# Altium project main board.PrjPcb
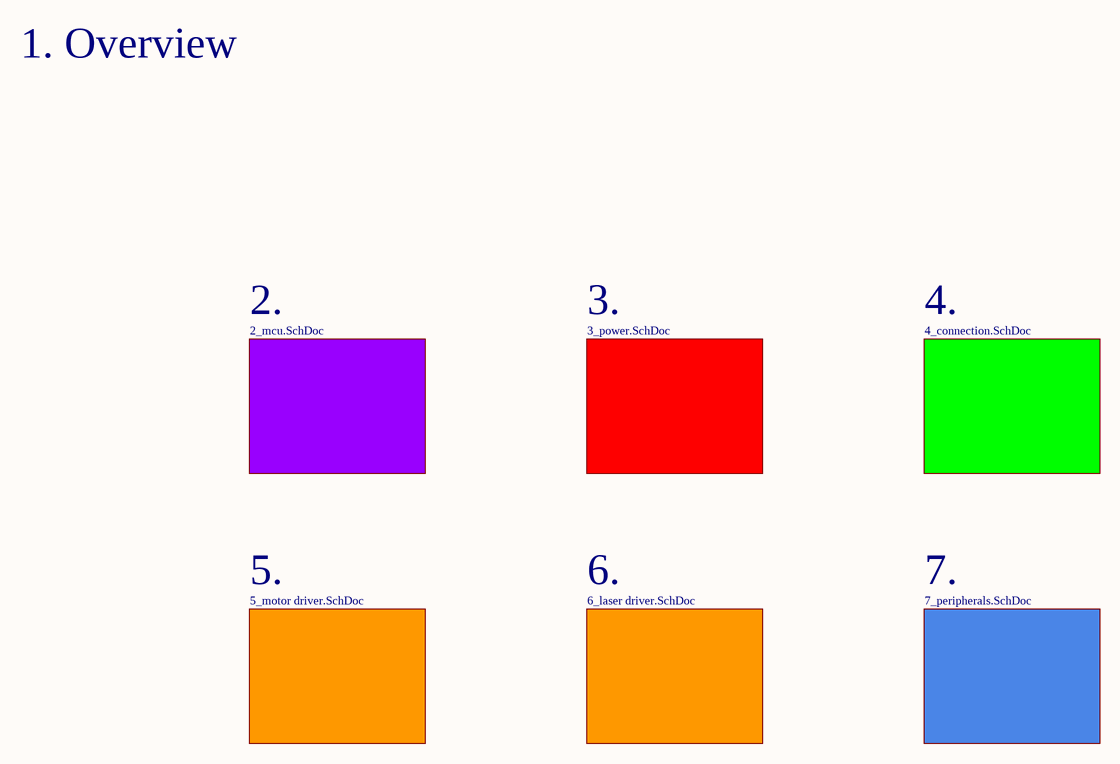
[diagram p0: 1_overview.SchDoc]
7 sheets, 131 parts. Net scope: flat (ports and power ports of the same name join across sheets).
Board files: main board.PcbDoc, panel.PcbDoc
Sheets:
  1_overview.SchDoc
    Designator = 2_mcu.SchDoc
    Designator = 3_power.SchDoc
    Designator = 4_connection.SchDoc
    Designator = 5_motor driver.SchDoc
    Designator = 6_laser driver.SchDoc
    Designator = 7_peripherals.SchDoc

## Sheet 1_overview.SchDoc
size A4; SheetNumber: 1; SheetTotal: 7

### Sub-sheets
Designator = 2_mcu.SchDoc: no entries
Designator = 3_power.SchDoc: no entries
Designator = 4_connection.SchDoc: no entries
Designator = 5_motor driver.SchDoc: no entries
Designator = 6_laser driver.SchDoc: no entries
Designator = 7_peripherals.SchDoc: no entries

### Notes on the sheet
- 1. Overview
- 2.
- 3.
- 4.
- 5.
- 6.
- 7.

## Sheet 2_mcu.SchDoc
size A4; SheetNumber: 2; SheetTotal: 7
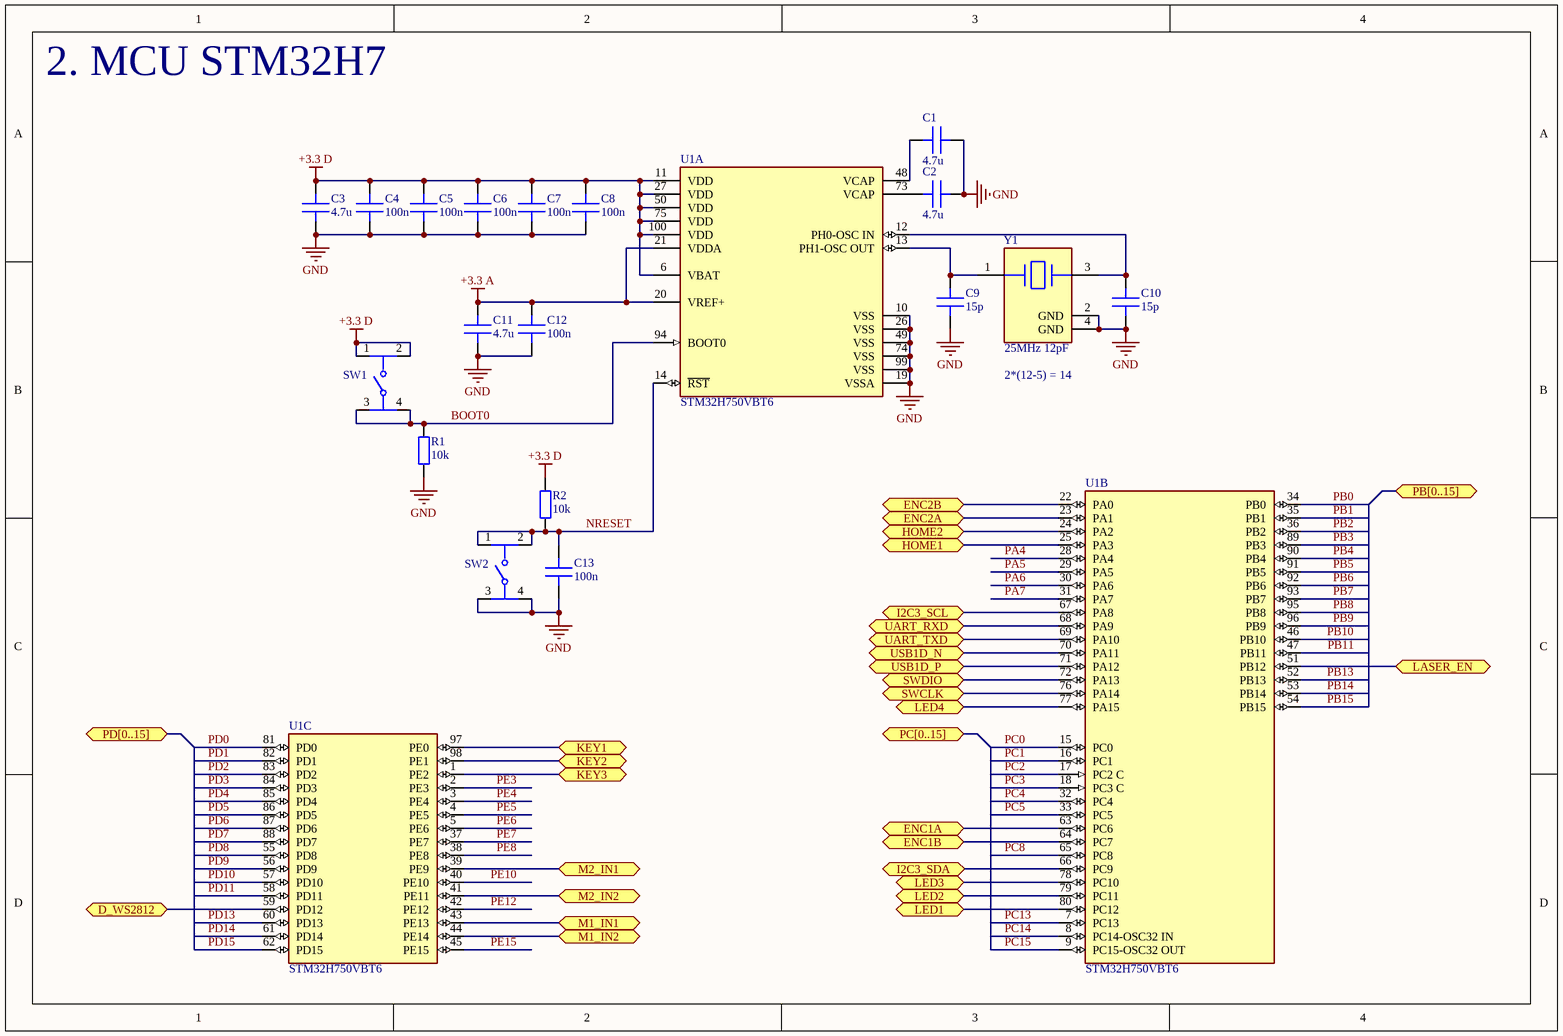
[diagram p1: 2_mcu.SchDoc]

### Parts
C1  4.7u  [IPC C C0603 NO SILK]
C2  4.7u  [IPC C C0603 NO SILK]
C3  4.7u  [IPC C C0603 NO SILK]
C4  100n  [IPC C C0402 NO SILK]
C5  100n  [IPC C C0402 NO SILK]
C6  100n  [IPC C C0402 NO SILK]
C7  100n  [IPC C C0402 NO SILK]
C8  100n  [IPC C C0402 NO SILK]
C9  15p  [IPC C C0402 NO SILK]
C10  15p  [IPC C C0402 NO SILK]
C11  4.7u  [IPC C C0603 NO SILK]
C12  100n  [IPC C C0402 NO SILK]
C13  100n  [IPC C C0402 NO SILK]
R1  10k  [IPC C R0402 NO SILK]
R2  10k  [IPC C R0402 NO SILK]
SW1  PTS810SJM250SMTRLFS  [FP-PTS810SJM250SMTRLFS-MFG]  (value not drawn)
SW2  PTS810SJM250SMTRLFS  [FP-PTS810SJM250SMTRLFS-MFG]  (value not drawn)
U1  STM32H750VBT6  [FP-LQFP100-1L-MFG]  (parts A,B,C of 3)
Y1  ABM8G-25.000MHZ-B4Y-T  [FP-ABM8G-MFG]  (value not drawn)

### Ports
D_WS2812 (bidir, see 7_peripherals[1B]), ENC1A (bidir, see 5_motor driver[4C]), ENC1B (bidir, see 5_motor driver[4C]), ENC2A (bidir, see 5_motor driver[3C]), ENC2B (bidir, see 5_motor driver[3C]), HOME1 (bidir, see 5_motor driver[4C]), HOME2 (bidir, see 5_motor driver[3C]), I2C3_SCL (bidir, see 7_peripherals[4B]), I2C3_SDA (bidir, see 7_peripherals[4B]), KEY1 (bidir, see 7_peripherals[1D]), KEY2 (bidir, see 7_peripherals[2D]), KEY3 (bidir, see 7_peripherals[2D]), LASER_EN (bidir, see 6_laser driver[3C]), LED1 (bidir, see 7_peripherals[1B]), LED2 (bidir, see 7_peripherals[1C]), LED3 (bidir, see 7_peripherals[1C]), LED4 (bidir, see 7_peripherals[1C]), M1_IN1 (bidir, see 5_motor driver[2B]), M1_IN2 (bidir, see 5_motor driver[2B]), M2_IN1 (bidir, see 5_motor driver[1C]), M2_IN2 (bidir, see 5_motor driver[1C]), PB[0..15] (bidir, see 7_peripherals[3C]), PC[0..15] (bidir), PD[0..15] (bidir, see 7_peripherals[3C]), SWCLK (bidir, see 4_connection[3B]), SWDIO (bidir, see 4_connection[3B]), UART_RXD (bidir, see 4_connection[3C]), UART_TXD (bidir, see 4_connection[3C]), USB1D_N (bidir, see 4_connection[2A]), USB1D_P (bidir, see 4_connection[2A])

### Nets
+3.3 A: C11.2 C12.2 U1.20(VREF+) U1.21(VDDA)
+3.3 D: C3.2 C4.2 C5.2 C6.2 C7.2 C8.2 R2.1 SW1.1 SW1.2 U1.6(VBAT) U1.11(VDD) U1.27(VDD) U1.50(VDD) U1.75(VDD) U1.100(VDD)
GND: C1.1 C2.1 C3.1 C4.1 C5.1 C6.1 C7.1 C8.1 C9.1 C10.1 C11.1 C12.1 C13.1 R1.2 SW2.3 SW2.4 U1.10(VSS) U1.19(VSSA) U1.26(VSS) U1.49(VSS) U1.74(VSS) U1.99(VSS) Y1.2(GND) Y1.4(GND)
BOOT0: R1.1 SW1.3 SW1.4 U1.94(BOOT0)
D_WS2812: U1.59(PD12) ; port D_WS2812
ENC1A: U1.63(PC6) ; port ENC1A
ENC1B: U1.64(PC7) ; port ENC1B
ENC2A: U1.23(PA1) ; port ENC2A
ENC2B: U1.22(PA0) ; port ENC2B
HOME1: U1.25(PA3) ; port HOME1
HOME2: U1.24(PA2) ; port HOME2
I2C3_SCL: U1.67(PA8) ; port I2C3_SCL
I2C3_SDA: U1.66(PC9) ; port I2C3_SDA
KEY1: U1.97(PE0) ; port KEY1
KEY2: U1.98(PE1) ; port KEY2
KEY3: U1.1(PE2) ; port KEY3
LASER_EN: U1.51(PB12) ; port LASER_EN
LED1: U1.80(PC12) ; port LED1
LED2: U1.79(PC11) ; port LED2
LED3: U1.78(PC10) ; port LED3
LED4: U1.77(PA15) ; port LED4
M1_IN1: U1.43(PE13) ; port M1_IN1
M1_IN2: U1.44(PE14) ; port M1_IN2
M2_IN1: U1.39(PE9) ; port M2_IN1
M2_IN2: U1.41(PE11) ; port M2_IN2
NRESET: C13.2 R2.2 SW2.1 SW2.2 U1.14(~{RST})
PA4: U1.28(PA4)
PA5: U1.29(PA5)
PA6: U1.30(PA6)
PA7: U1.31(PA7)
PB0: U1.34(PB0)
PB1: U1.35(PB1)
PB2: U1.36(PB2)
PB3: U1.89(PB3)
PB4: U1.90(PB4)
PB5: U1.91(PB5)
PB6: U1.92(PB6)
PB7: U1.93(PB7)
PB8: U1.95(PB8)
PB9: U1.96(PB9)
PB10: U1.46(PB10)
PB11: U1.47(PB11)
PB13: U1.52(PB13)
PB14: U1.53(PB14)
PB15: U1.54(PB15)
PC0: U1.15(PC0)
PC1: U1.16(PC1)
PC2: U1.17(PC2_C)
PC3: U1.18(PC3_C)
PC4: U1.32(PC4)
PC5: U1.33(PC5)
PC8: U1.65(PC8)
PC13: U1.7(PC13)
PC14: U1.8(PC14-OSC32_IN)
PC15: U1.9(PC15-OSC32_OUT)
PD0: U1.81(PD0)
PD1: U1.82(PD1)
PD2: U1.83(PD2)
PD3: U1.84(PD3)
PD4: U1.85(PD4)
PD5: U1.86(PD5)
PD6: U1.87(PD6)
PD7: U1.88(PD7)
PD8: U1.55(PD8)
PD9: U1.56(PD9)
PD10: U1.57(PD10)
PD11: U1.58(PD11)
PD13: U1.60(PD13)
PD14: U1.61(PD14)
PD15: U1.62(PD15)
PE3: U1.2(PE3)
PE4: U1.3(PE4)
PE5: U1.4(PE5)
PE6: U1.5(PE6)
PE7: U1.37(PE7)
PE8: U1.38(PE8)
PE10: U1.40(PE10)
PE12: U1.42(PE12)
PE15: U1.45(PE15)
RXD: U1.68(PA9) ; port UART_RXD
SWCLK: U1.76(PA14) ; port SWCLK
SWDIO: U1.72(PA13) ; port SWDIO
TXD: U1.69(PA10) ; port UART_TXD
USB1D_N: U1.70(PA11) ; port USB1D_N
USB1D_P: U1.71(PA12) ; port USB1D_P
NetC1_2: C1.2 U1.48(VCAP)
NetC2_2: C2.2 U1.73(VCAP)
NetC9_2: C9.2 U1.13(PH1-OSC_OUT) Y1.1
NetC10_2: C10.2 U1.12(PH0-OSC_IN) Y1.3

### Notes on the sheet
- 2. MCU STM32H7
- (near Y1) 25MHz 12pF
- (near Y1) 2*(12-5) = 14

### Library data of the parts
C1-C3 C11 = Generic CAP 0603: Value: 4.7u
C4-C10 C12 C13 = Generic CAP 0402
  C4-C8 C12 C13: Value: 100n
  C9 C10: Value: 15p
R1 R2 = Generic RES 0402: Value: 10k
SW1 SW2 = CMP-10040-000001-2: SWITCH TACTILE SPST-NO 0.05A 16V; Throw Configuration: SPST; Operating Force: 160gf; Actuator Type: Standard; Switch Travel: 0.15mm; Switch Function: Off-Mom; Max Current Rating: 50mA; Mechanical Life: 150000Cycles; Illumination Type: Non-Illuminated; Package Quantity: 2900; Depth: 4.6mm; Mount: Surface Mount; Packaging: Tape and Reel; Length: 3.2mm; RoHS Compliant: Yes; Case/Package: SMD/SMT; Voltage Rating (DC): 16V; Min Operating Temperature: -40°C; Termination: J-Bend; Lead Free: Lead Free; Contact Plating: Silver; Orientation: Straight; Max Operating Temperature: 85°C; Current Rating: 50mA; Color: Black
U1 = CMP-12105-000017-1: IC MCU 32BIT 128KB FLASH 100LQFP; Manufacturer: STMicroelectronics; Number Of Uart Channels: 9; Number Of I/Os: 82; Max Junction Temp: +125°C; Data Bus Width: 32bits; Ram Size: 1MBytes; Min Supply Voltage: 1.62V; Number Of Spi Channels: 6; Number Of Adc Channels: 36; Max Supply Voltage: 3.6V; Standoff Height: 0.05mm; Interface: I2C,SPI,UART,USART,CAN,USB,LIN,IrDA,Ethernet,I2S,Other; Number Of A/D Converters: 3; Number Of I2C Channels: 4; Memory Size: 128KBytes; Frequency: 480MHz; Number Of Timers/Counters: 20; Number Of Ethernet Channels: 1; Core Architecture: ARM Cortex-M7; Number Of Usb Channels: 2; Number Of Pwm Channels: 42; Ambient Temperature Range High: +85°C; Temperature: -40°C to +125°C; ComponentLink2URL: https://www.st.com/resource/en/datasheet/stm32h750vb.pdf; Device Class L2: Embedded Processors and Controllers; Temperature Range Low: -40°C; Octopart: https://octopart.com/stm32h750vbt6-stmicroelectronics-94048547; Category: IC; Manufacturer Part Number: STM32H750VBT6; Height: 1.6mm; Lead Free: Yes; Device Class L1: Integrated Circuits (ICs); Digikey Description: IC MCU 32BIT 128KB FLASH 100LQFP; RoHS: TRUE; Ambient Temperature Range Low: -40°C; Device Class L3: Microcontrollers; ComponentLink2Description: Datasheet; Mouser Description: MCU 32-Bit STM32H750VB ARM Cortex M7 RISC 128KB Flash 1.8V/2.5V/3.3V 100-Pin LQFP Tray; Number Of Cores: 1; Automotive: No; Memory Type: FLASH; Package: LQFP100-1L; Temperature Range High: +125°C
Y1 = CMP-27762-000021-2: Crystal 25MHz ±30ppm (Tol) ±30ppm (Stability) 10pF FUND 60Ω 4-Pin SMD T/R; ESR (Equivalent Series Resistance): 60R; Depth: 2.5mm; Frequency Stability: 30ppm; Mount: Surface Mount; Lead Free: Lead Free; Max Operating Temperature: 70°C; Series: ABM8G; Frequency Tolerance: 30ppm; Min Operating Temperature: -20°C; Number of Pins: 4; Operating Frequency: 25 MHz; Termination: SMD/SMT; Frequency: 25MHz; Case/Package: CSMD; Packaging: Tape and Reel; Package Quantity: 1000; Tolerance: 30ppm; Length: 3.2mm; Height: 0.039inch; Load Capacitance: 10pF; Width: 0.098inch; Series Resistance: 60R

## Sheet 3_power.SchDoc
size A4; SheetNumber: 3; SheetTotal: 6
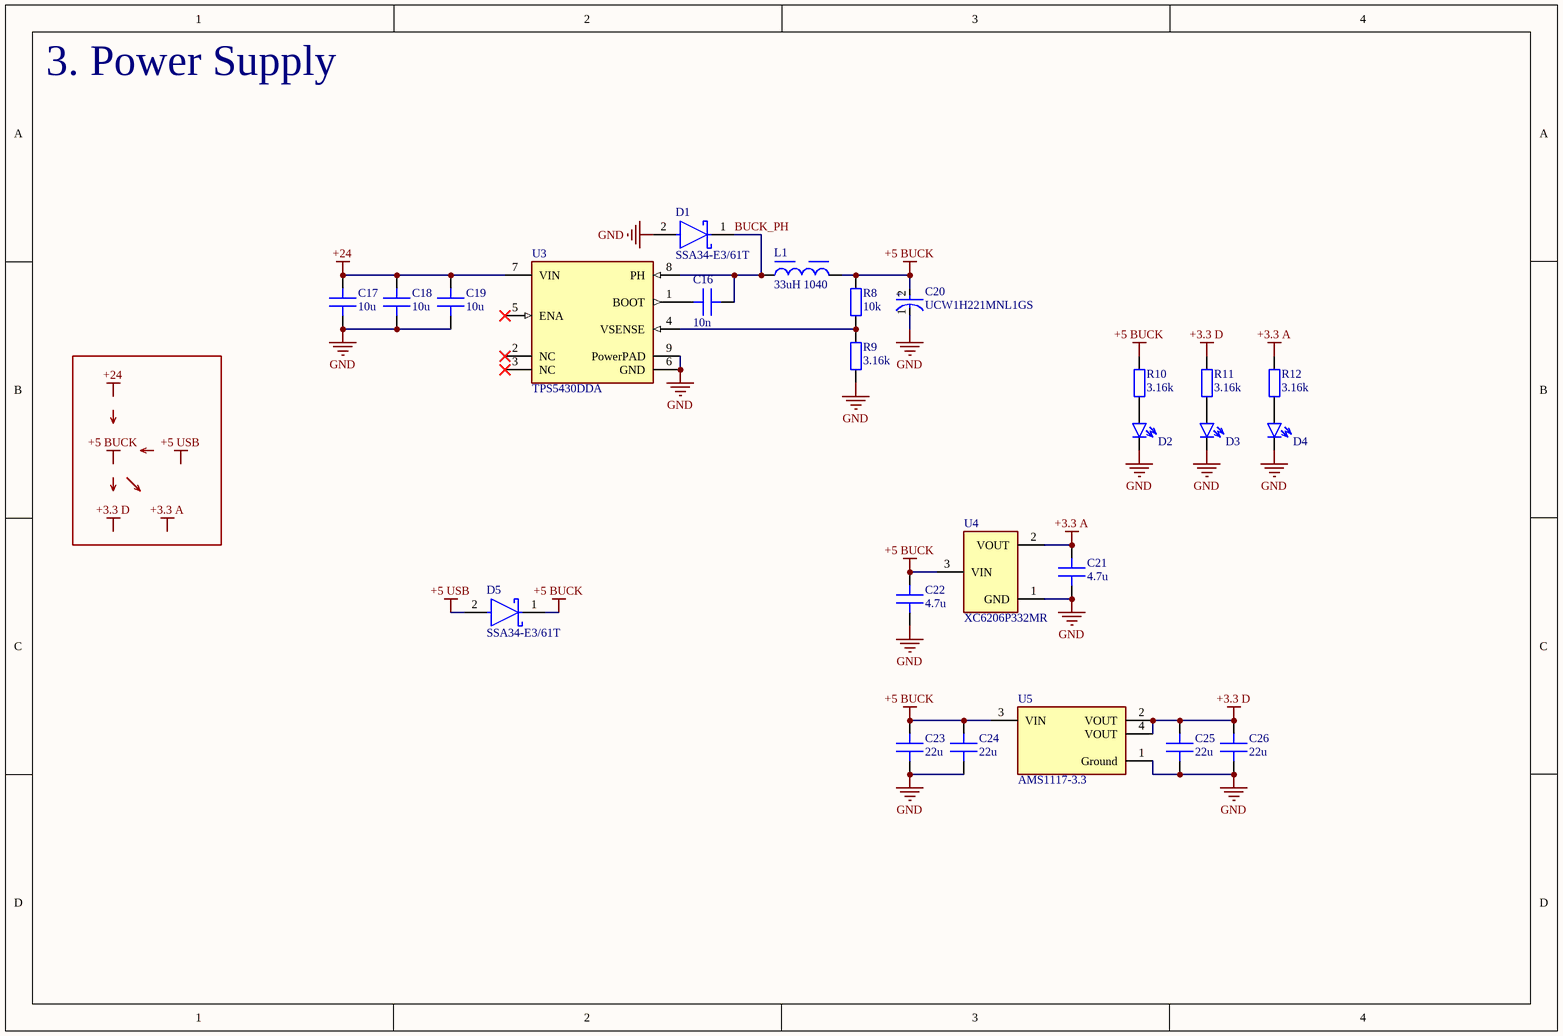
[diagram p2: 3_power.SchDoc]

### Parts
C16  10n  [IPC C C0402 NO SILK]
C17  10u  [IPC C C1210 NO SILK]
C18  10u  [IPC C C1210 NO SILK]
C19  10u  [IPC C C1210 NO SILK]
C20  UCW1H221MNL1GS  [FP-UCW1H221MNL1GS-MFG]
C21  4.7u  [IPC C C0603 NO SILK]
C22  4.7u  [IPC C C0603 NO SILK]
C23  22u  [IPC C C0603 NO SILK]
C24  22u  [IPC C C0603 NO SILK]
C25  22u  [IPC C C0603 NO SILK]
C26  22u  [IPC C C0603 NO SILK]
D1  SSA34-E3/61T  [FP-95400-MFG]
D2  Red LED 0603  [IPC C D0603]  (value not drawn)
D3  Yellow LED 0603  [IPC C D0603]  (value not drawn)
D4  Yellow LED 0603  [IPC C D0603]  (value not drawn)
D5  SSA34-E3/61T  [FP-95400-MFG]
L1  33uH 1040  [WE-LHMI_1040]
R8  10k  [IPC C R0402 NO SILK]
R9  3.16k  [IPC C R0402 NO SILK]
R10  3.16k  [IPC C R0402 NO SILK]
R11  3.16k  [IPC C R0402 NO SILK]
R12  3.16k  [IPC C R0402 NO SILK]
U3  TPS5430DDA  [FP-DDA0008J-MFG]
U4  XC6206P332MR  [SOT23-3]
U5  AMS1117-3.3  [FP-AMS1117-IPC_C]

### Nets
+3.3 A: C21.2 R12.2 U4.2(VOUT)
+3.3 D: C25.2 C26.2 R11.2 U5.2(VOUT) U5.4(VOUT)
+5 BUCK: C20.2(A) C22.2 C23.2 C24.2 D5.1(C) L1.2 R8.2 R10.2 U4.3(VIN) U5.3(VIN)
+5 USB: D5.2(A)
+24: C17.1 C18.1 C19.1 U3.7(VIN)
GND: C17.2 C18.2 C19.2 C20.1(C) C21.1 C22.1 C23.1 C24.1 C25.1 C26.1 D1.2(A) D2.2(C) D3.2(C) D4.2(C) R9.1 U3.6(GND) U3.9(PowerPAD) U4.1(GND) U5.1(Ground)
BUCK_PH: C16.2 D1.1(C) L1.1 U3.8(PH)
NetC16_1: C16.1 U3.1(BOOT)
NetD2_1: D2.1(A) R10.1
NetD3_1: D3.1(A) R11.1
NetD4_1: D4.1(A) R12.1
NetR8_1: R8.1 R9.2 U3.4(VSENSE)

Not connected (* = marked no-connect by the designer): U3 2(NC)* 3(NC)* 5(ENA)*

### Notes on the sheet
- 3. Power Supply
- Labels drawn without touching a wire or pin: +3.3 A, +3.3 D, +5 BUCK, +5 USB, +24
- (in symbol CMP-12462-000041-1) +

### Library data of the parts
C16 = Generic CAP 0402: Value: 10n
C17-C19 = Generic CAP 1210: Value: 10u
C20 = CMP-12462-000041-1: CAP ALUM 220UF 20% 50V SMD; Dissipation Factor: 0.14%; Ripple Current: 670mA; Dielectric Material: Aluminium; Life (Hours): 7000Hour; Impedance: 350mR; Leakage Current: 3uA; Capacitance: 220uF; Max Operating Temperature: 105°C; Features: General Purpose; Voltage Rating: 50V; Case/Package: Radial; Termination: SMD/SMT; Tolerance: 20%; Package Quantity: 500; Construction: Cylindrical; REACH SVHC: No SVHC; Width: 10.3mm; Min Operating Temperature: -25°C; RoHS Compliant: Yes; Mount: Surface Mount; Diameter: 10mm; Voltage: 50V; Series: CW; Voltage Rating (DC): 50V; Ripple Current (AC): 670mA; Radiation Hardening: No; Length: 10mm; Packaging: Tape and Reel; Height: 10mm; Height - Seated (Max): 0.394inch
C21-C26 = Generic CAP 0603
  C21 C22: Value: 4.7u
  C23-C26: Value: 22u
D1 D5 = CMP-02539-000022-2: DIODE SCHOTTKY 40V 3A DO214AC; Element Configuration: Single; Max Reverse Leakage Current: 200uA; Polarity: Standard; Peak Non-Repetitive Surge Current: 75A; Forward Voltage: 490mV; Radiation Hardening: No; Current Rating: 3A; Contact Plating: Tin; Output Current: 3A; Height: 2.087mm; Mount: Surface Mount; Case/Package: SMA; Packaging: Tape and Reel; Width: 2.79mm; Average Rectified Current: 3A; Max Repetitive Reverse Voltage (Vrrm): 40V; Max Operating Temperature: 150°C; Length: 4.5mm; RoHS Compliant: Yes; Max Reverse Current: 200uA; Voltage Rating (DC): 40V; Min Operating Temperature: -65°C; Max Reverse Voltage (DC): 40V; Number of Pins: 2; Max Forward Surge Current (Ifsm): 75A; Lead Free: Lead Free; Forward Current: 3A; Max Surge Current: 75A; Package Quantity: 1
D2-D4 = Generic LED 0603
L1 = CMP-1353-00014-4: NexarPartId: 67091305; Saturation Current: 3.3A; DC Resistance (DCR): 92mΩ; Inductance Tolerance: 20%; Inductance: 33µH; Max Operating Temperature: 125°C; Ambient Temperature Range High: 85°C; Min Operating Temperature: -40°C; Length: 11mm; Ambient Temperature Range Low: -40°C; Height: 3.8mm; Width: 10mm; RoHS: Compliant
R8-R12 = Generic RES 0402
  R8: Value: 10k
  R9-R12: Value: 3.16k
U3 = CMP-2000-04960-2: IC REG BUCK ADJUSTABLE 3A 8SOPWR; Manufacturer: Texas Instruments; Max Junction Temp: +125°C; Max Supply Voltage: 36V; Switching Frequency: 500kHz; Output Type: AdjustableProgrammable; Standoff Height: 0mm; Output Voltage: 1.23-31V; Max Duty Cycle: 89%; Nominal Supply Current: 3mA; Min Supply Voltage: 5.5V; Number Of Outputs: 1; Temperature: -40°C to +125°C; Temperature Range High: +125°C; Manufacturer Part Number: TPS5430DDA; Device Class L3: Voltage Regulators - Switching; Mouser Description: Voltage Regulators - Switching Regulators 5.5 to 36V Input 3A Step Dwn Converter; Switching Topology: Buck; ComponentLink2URL: http://www.ti.com/lit/ds/symlink/tps5431.pdf; ComponentLink2Description: Datasheet; Device Class L2: Power Management ICs; Device Class L1: Integrated Circuits (ICs); Digikey Description: IC REG BUCK ADJUSTABLE 3A 8SOPWR; RoHS: TRUE; Octopart: https://octopart.com/tps5430dda-texas+instruments-589977; Output Current: 3A; Automotive: No; Lead Free: Yes; Category: IC; Package: DDA0008J; Temperature Range Low: -40°C; Height: 1.7mm
U4 = 3.3V Regulator XC6206P332MR_C5446: Output Type: Output Polarity:Positive Number of Outputs:1 Maximum Input Voltage:6V Output Voltage:3.3V~3.3V Output Voltage:3.3V~3.3V Dropout Voltage:680mV@(100mA) Output Current:200mA Power Supply Rejection Ratio (PSRR):-; Manufacturer: TOREX(特瑞仕); Add into BOM: yes; Number of Outputs: 1; Maximum Input Voltage: 6V; Output Current: 200mA; Symbol: XC6206P332MR; Device: XC6206P332MR_C5446; LCSC Part Name: 正 Vin=6V Vout=3.3V 200mA; Supplier Part: C5446; Manufacturer Part: XC6206P332MR; Supplier Footprint: SOT-23-3L; JLCPCB Part Class: Basic Part; Datasheet: https://atta.szlcsc.com/upload/public/pdf/source/20130801/1457706628791.pdf; Supplier: LCSC; Convert to PCB: yes; Output Polarity: Positive; Output Voltage: 3.3V~3.3V; Dropout Voltage: 680mV@(100mA); Power Supply Rejection Ratio (PSRR): -
U5 = CMP-209535-000001-1: LDO Voltage Regulators 1A, 3.3V; Manufacturer: Advanced Monolithic Systems; Dropout Voltage: 1.1V; Output Type: Fixed; Nominal Supply Current: 5mA; Max Power Dissipation: 1.2W; Max Supply Voltage: 15V; Number Of Outputs: 1; Standoff Height: 0.64mm; Max Junction Temp: +125°C; Height: 1.8mm; Package: AMS1117; Device Class L2: Power Management ICs; ComponentLink2Description: Datasheet; ComponentLink2URL: http://www.advanced-monolithic.com/pdf/ds1117.pdf; Category: IC; RoHS: TRUE; Automotive: No; Device Class L1: Integrated Circuits (ICs); Output Current: 1A; Device Class L3: Voltage Regulators - Linear; Temperature: -40°C to +125°C; Output Voltage: 3.3V; Manufacturer Part Number: AMS1117-3.3; Temperature Range Low: -40°C; Octopart: https://octopart.com/ams1117-3.3-advanced+monolithic+systems-25899300; Lead Free: Yes; Ipc Land Pattern Name: SOT229P700X180-4; Temperature Range High: +125°C

## Sheet 4_connection.SchDoc
size A4; SheetNumber: 4; SheetTotal: 7
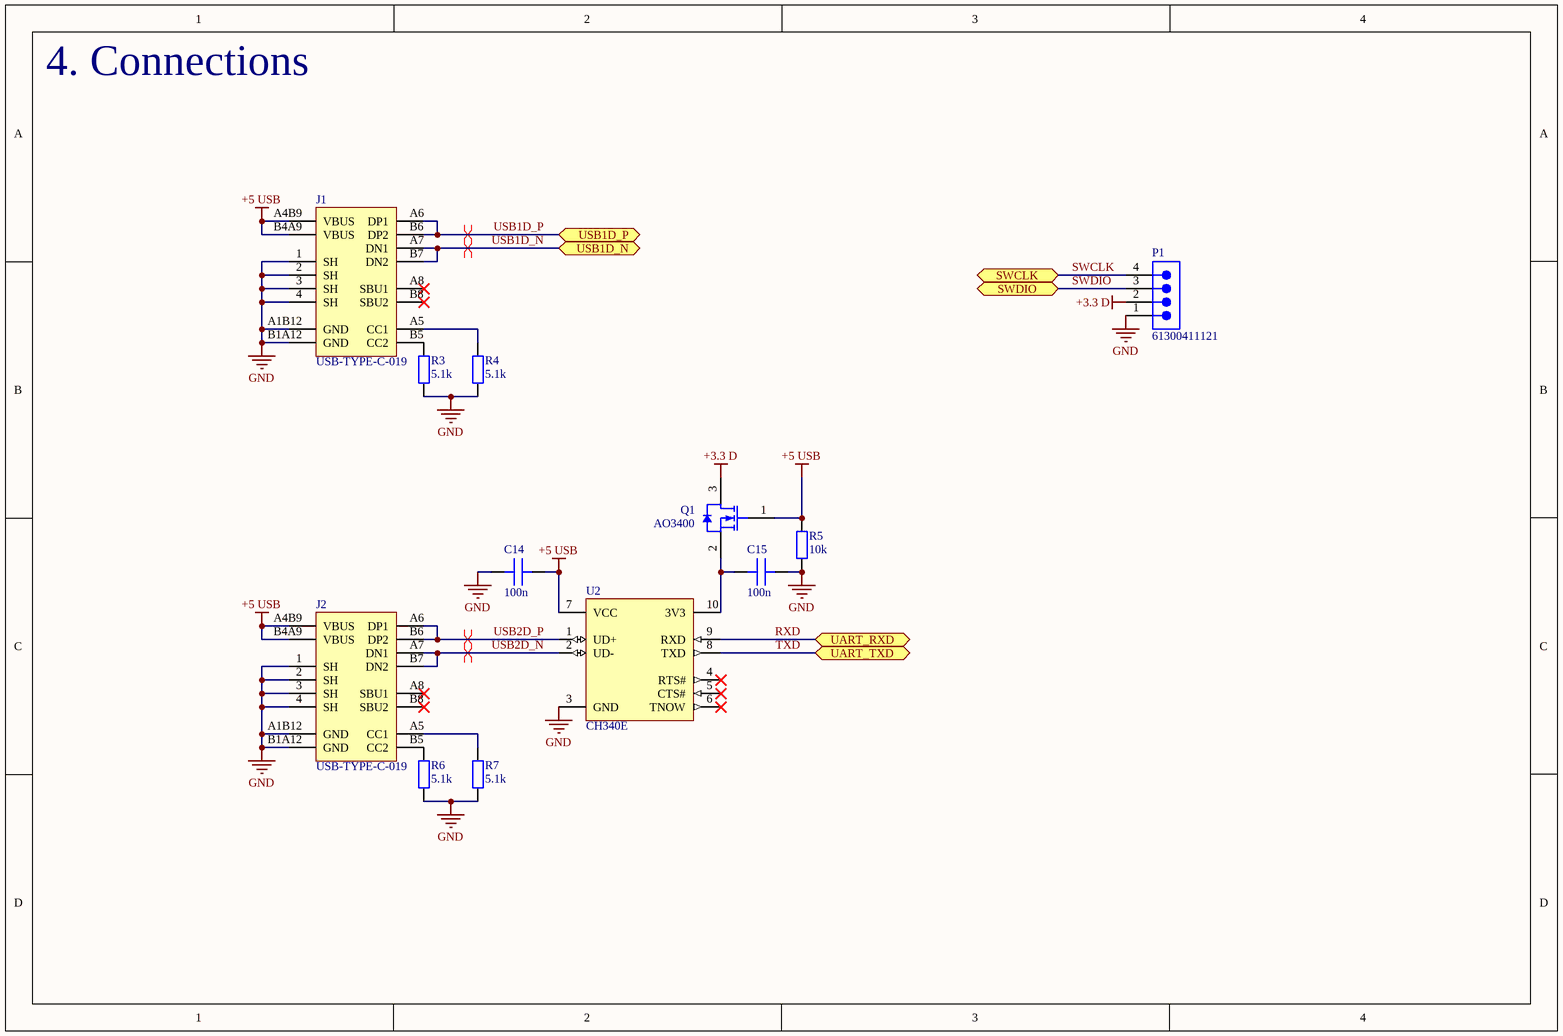
[diagram p3: 4_connection.SchDoc]

### Parts
C14  100n  [IPC C C0402 NO SILK]
C15  100n  [IPC C C0402 NO SILK]
J1  USB-TYPE-C-019  [USB-TYPE-C-12+4P]
J2  USB-TYPE-C-019  [USB-TYPE-C-12+4P]
P1  61300411121  [61300411121]
Q1  AO3400  [AO-SOT23-3_V]
R3  5.1k  [IPC C R0402 NO SILK]
R4  5.1k  [IPC C R0402 NO SILK]
R5  10k  [IPC C R0402 NO SILK]
R6  5.1k  [IPC C R0402 NO SILK]
R7  5.1k  [IPC C R0402 NO SILK]
U2  CH340E  [MSOP-UN10_L]

### Ports
SWCLK (bidir, see 2_mcu[3C]), SWDIO (bidir, see 2_mcu[3C]), UART_RXD (bidir, see 2_mcu[3C]), UART_TXD (bidir, see 2_mcu[3C]), USB1D_N (bidir, see 2_mcu[3C]), USB1D_P (bidir, see 2_mcu[3C])

### Nets
+3.3 D: P1.2 Q1.3(D)
+5 USB: C14.2 J1.A4B9(VBUS) J1.B4A9(VBUS) J2.A4B9(VBUS) J2.B4A9(VBUS) Q1.1(G) R5.2 U2.7(VCC)
GND: C14.1 C15.1 J1.1(SH) J1.2(SH) J1.3(SH) J1.4(SH) J1.A1B12(GND) J1.B1A12(GND) J2.1(SH) J2.2(SH) J2.3(SH) J2.4(SH) J2.A1B12(GND) J2.B1A12(GND) P1.1 R3.1 R4.1 R5.1 R6.1 R7.1 U2.3(GND)
RXD: U2.9(RXD) ; port UART_RXD
SWCLK: P1.4 ; port SWCLK
SWDIO: P1.3 ; port SWDIO
TXD: U2.8(TXD) ; port UART_TXD
USB1D_N: J1.A7(DN1) J1.B7(DN2) ; port USB1D_N
USB1D_P: J1.A6(DP1) J1.B6(DP2) ; port USB1D_P
USB2D_N: J2.A7(DN1) J2.B7(DN2) U2.2(UD-)
USB2D_P: J2.A6(DP1) J2.B6(DP2) U2.1(UD+)
NetC15_2: C15.2 Q1.2(S) U2.10(3V3)
NetJ1_A5: J1.A5(CC1) R4.2
NetJ1_B5: J1.B5(CC2) R3.2
NetJ2_A5: J2.A5(CC1) R7.2
NetJ2_B5: J2.B5(CC2) R6.2

Not connected (* = marked no-connect by the designer): J1 A8(SBU1)* B8(SBU2)*; J2 A8(SBU1)* B8(SBU2)*; U2 4(RTS#)* 5(CTS#)* 6(TNOW)*

### Layout directives
differential pair: USB1D_N, USB1D_P, USB2D_N, USB2D_P

### Notes on the sheet
- 4. Connections

### Library data of the parts
C14 C15 = Generic CAP 0402: Value: 100n
J1 J2 = USB-TYPE-C-019: Connector Type:Type-C Standard:- Gender:Female Number of Contacts:16 Number of Ports:1 Mounting Style:Surface Mount Current Rating - Power (Max):3A Operating Temperature Range:-25℃~+85℃ Operating Temperature Range:-25℃~+85℃; Manufacturer: DEALON(德艺隆); Add into BOM: yes; Connector Type: Type-C; Gender: Female; Number of Contacts: 16; Number of Ports: 1; Current Rating - Power (Max): 3A; Symbol: USB-TYPE-C-019; Device: USB-TYPE-C-019; LCSC Part Name: Type-C 母座 卧贴; Supplier Part: C2927039; Manufacturer Part: USB-TYPE-C-019; Supplier Footprint: SMD; JLCPCB Part Class: Extended Part; Datasheet: https://atta.szlcsc.com/upload/public/pdf/source/20211217/CCD3D517E355E8E0CC52ABD8D5784AD8.pdf; Supplier: LCSC; Convert to PCB: yes; Standard: -; Mounting Style: Surface Mount; Operating Temperature Range: -25℃~+85℃
P1 = CMP-1502-01064-2: NexarPartId: 32855522; Pitch: 2.54mm; Number of Contacts: 4; Contact Resistance: 20mΩ; Gender: Male; Current Rating: 3A; Connector Type: Male Pin; Voltage Rating: 250V; Lead Free: Lead Free; Contact Plating: Gold; Max Operating Temperature: 105°C; Packaging: Bulk; Height: 8.89mm; Orientation: Vertical; Contact Mating Length: 5.9944mm; Contact Material: Copper; Lead Pitch: 2.54mm; Min Operating Temperature: -40°C; Termination: Solder; Color: Black; Number of Rows: 1; REACH SVHC: Unknown; RoHS: Compliant; Mount: Through Hole; Number of Positions: 4; Number of Pins: 4; Operating Supply Voltage: 250V
Q1 = CMP-0278-00001-1: N-channel Enhancement Mode Field-Effect Transistor; 5.8A/30V; Manufacturer: Alpha and Omega; Channel Type: N; Drain-Source Voltage Limit: 30 V; Junction Temperature: -55 to 150 degC; Gate-Source Voltage Limit: +/-12 V; PackageDescription: 3-Pin SOT23, 3.016 x 2.8 mm Body, 0.95 mm Pitch; ComponentLink2Description: Datasheet; DatasheetVersion: Rev.8, 12/2011; ComponentLink3URL: http://www.aosmd.com/res/packaging_information/SOT-23.pdf; Storage Temperature: -55 to 150 degC; ComponentLink3Description: Package Specification; PackageReference: SOT23; ComponentLink1Description: Manufacturer URL; Mounting Technology: Surface Mount; ComponentLink1URL: http://www.aosmd.com/; PartNumber: AO3400; ComponentLink2URL: http://www.aosmd.com/res/data_sheets/AO3400.pdf
R3-R7 = Generic RES 0402
  R3 R4 R6 R7: Value: 5.1k
  R5: Value: 10k

## Sheet 5_motor driver.SchDoc
size A4; SheetNumber: 5; SheetTotal: 7
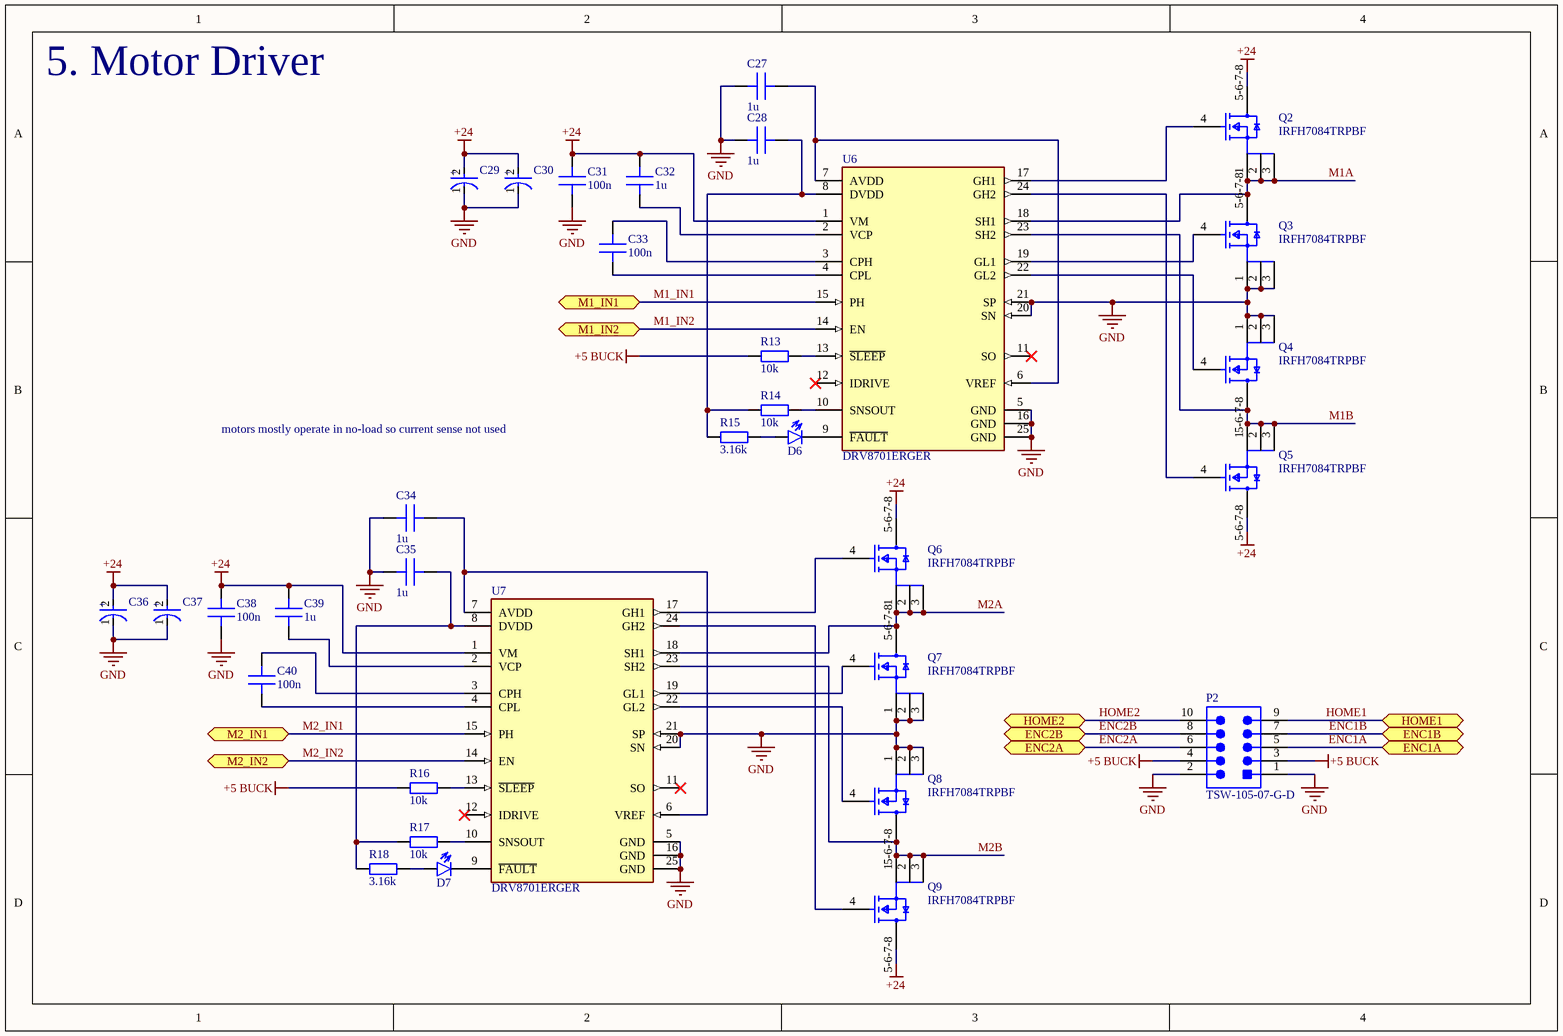
[diagram p4: 5_motor driver.SchDoc]

### Parts
C27  1u  [IPC C C0402 NO SILK]
C28  1u  [IPC C C0402 NO SILK]
C29  UCW1H221MNL1GS  [FP-UCW1H221MNL1GS-MFG]  (value not drawn)
C30  UCW1H221MNL1GS  [FP-UCW1H221MNL1GS-MFG]  (value not drawn)
C31  100n  [IPC C C0603 NO SILK]
C32  1u  [IPC C C0603 NO SILK]
C33  100n  [IPC C C0603 NO SILK]
C34  1u  [IPC C C0402 NO SILK]
C35  1u  [IPC C C0402 NO SILK]
C36  UCW1H221MNL1GS  [FP-UCW1H221MNL1GS-MFG]  (value not drawn)
C37  UCW1H221MNL1GS  [FP-UCW1H221MNL1GS-MFG]  (value not drawn)
C38  100n  [IPC C C0603 NO SILK]
C39  1u  [IPC C C0603 NO SILK]
C40  100n  [IPC C C0603 NO SILK]
D6  Red LED 0603  [IPC C D0603]  (value not drawn)
D7  Red LED 0603  [IPC C D0603]  (value not drawn)
P2  TSW-105-07-G-D  [SMTC-TSW-105-07-G-D_V]
Q2  IRFH7084TRPBF  [FP-PQFN5x6-G-MFG]
Q3  IRFH7084TRPBF  [FP-PQFN5x6-G-MFG]
Q4  IRFH7084TRPBF  [FP-PQFN5x6-G-MFG]
Q5  IRFH7084TRPBF  [FP-PQFN5x6-G-MFG]
Q6  IRFH7084TRPBF  [FP-PQFN5x6-G-MFG]
Q7  IRFH7084TRPBF  [FP-PQFN5x6-G-MFG]
Q8  IRFH7084TRPBF  [FP-PQFN5x6-G-MFG]
Q9  IRFH7084TRPBF  [FP-PQFN5x6-G-MFG]
R13  10k  [IPC C R0402 NO SILK]
R14  10k  [IPC C R0402 NO SILK]
R15  3.16k  [IPC C R0402 NO SILK]
R16  10k  [IPC C R0402 NO SILK]
R17  10k  [IPC C R0402 NO SILK]
R18  3.16k  [IPC C R0402 NO SILK]
U6  DRV8701ERGER  [FP-RGE0024F-MFG]
U7  DRV8701ERGER  [FP-RGE0024F-MFG]

### Ports
ENC1A (bidir, see 2_mcu[3D]), ENC1B (bidir, see 2_mcu[3D]), ENC2A (bidir, see 2_mcu[3C]), ENC2B (bidir, see 2_mcu[3B]), HOME1 (bidir, see 2_mcu[3C]), HOME2 (bidir, see 2_mcu[3C]), M1_IN1 (bidir, see 2_mcu[2D]), M1_IN2 (bidir, see 2_mcu[2D]), M2_IN1 (bidir, see 2_mcu[2D]), M2_IN2 (bidir, see 2_mcu[2D])

### Nets
+5 BUCK: P2.3 P2.4 R13.2 R16.2
+24: C29.2(A) C30.2(A) C31.2 C32.1 C36.2(A) C37.2(A) C38.2 C39.1 Q2.5-6-7-8(D) Q5.5-6-7-8(D) Q6.5-6-7-8(D) Q9.5-6-7-8(D) U6.1(VM) U7.1(VM)
GND: C27.1 C28.1 C29.1(C) C30.1(C) C31.1 C34.1 C35.1 C36.1(C) C37.1(C) C38.1 P2.1 P2.2 Q3.1(S) Q3.2(S) Q3.3(S) Q4.1(S) Q4.2(S) Q4.3(S) Q7.1(S) Q7.2(S) Q7.3(S) Q8.1(S) Q8.2(S) Q8.3(S) U6.5(GND) U6.16(GND) U6.20(SN) U6.21(SP) U6.25(GND) U7.5(GND) U7.16(GND) U7.20(SN) U7.21(SP) U7.25(GND)
ENC1A: P2.5 ; port ENC1A
ENC1B: P2.7 ; port ENC1B
ENC2A: P2.6 ; port ENC2A
ENC2B: P2.8 ; port ENC2B
HOME1: P2.9 ; port HOME1
HOME2: P2.10 ; port HOME2
M1_IN1: U6.15(PH) ; port M1_IN1
M1_IN2: U6.14(EN) ; port M1_IN2
M1A: Q2.1(S) Q2.2(S) Q2.3(S) Q3.5-6-7-8(D) U6.18(SH1)
M1B: Q4.5-6-7-8(D) Q5.1(S) Q5.2(S) Q5.3(S) U6.23(SH2)
M2_IN1: U7.15(PH) ; port M2_IN1
M2_IN2: U7.14(EN) ; port M2_IN2
M2A: Q6.1(S) Q6.2(S) Q6.3(S) Q7.5-6-7-8(D) U7.18(SH1)
M2B: Q8.5-6-7-8(D) Q9.1(S) Q9.2(S) Q9.3(S) U7.23(SH2)
NetC27_2: C27.2 U6.6(VREF) U6.7(AVDD)
NetC28_2: C28.2 R14.2 R15.2 U6.8(DVDD)
NetC32_2: C32.2 U6.2(VCP)
NetC33_1: C33.1 U6.3(CPH)
NetC33_2: C33.2 U6.4(CPL)
NetC34_2: C34.2 U7.6(VREF) U7.7(AVDD)
NetC35_2: C35.2 R17.2 R18.2 U7.8(DVDD)
NetC39_2: C39.2 U7.2(VCP)
NetC40_1: C40.1 U7.3(CPH)
NetC40_2: C40.2 U7.4(CPL)
NetD6_1: D6.1(A) R15.1
NetD6_2: D6.2(C) U6.9(~{FAULT})
NetD7_1: D7.1(A) R18.1
NetD7_2: D7.2(C) U7.9(~{FAULT})
NetQ2_4: Q2.4(G) U6.17(GH1)
NetQ3_4: Q3.4(G) U6.19(GL1)
NetQ4_4: Q4.4(G) U6.22(GL2)
NetQ5_4: Q5.4(G) U6.24(GH2)
NetQ6_4: Q6.4(G) U7.17(GH1)
NetQ7_4: Q7.4(G) U7.19(GL1)
NetQ8_4: Q8.4(G) U7.22(GL2)
NetQ9_4: Q9.4(G) U7.24(GH2)
NetR13_1: R13.1 U6.13(~{SLEEP})
NetR14_1: R14.1 U6.10(SNSOUT)
NetR16_1: R16.1 U7.13(~{SLEEP})
NetR17_1: R17.1 U7.10(SNSOUT)

Not connected (* = marked no-connect by the designer): U6 11(SO)* 12(IDRIVE)*; U7 11(SO)* 12(IDRIVE)*

### Notes on the sheet
- 5. Motor Driver
- motors mostly operate in no-load so current sense not used
- (in symbol CMP-12462-000041-1) +

### Library data of the parts
C27 C28 C34 C35 = Generic CAP 0402: Value: 1u
C29 C30 C36 C37 = CMP-12462-000041-1: as C20 on sheet 3_power; Capacitance: 220uF; Max Operating Temperature: 105°C; Features: General Purpose; Voltage Rating: 50V; Case/Package: Radial; Termination: SMD/SMT; Tolerance: 20%; Package Quantity: 500; Construction: Cylindrical; REACH SVHC: No SVHC; Width: 10.3mm; Min Operating Temperature: -25°C; RoHS Compliant: Yes; Mount: Surface Mount; Diameter: 10mm; Voltage: 50V; Series: CW; Voltage Rating (DC): 50V; Ripple Current (AC): 670mA; Radiation Hardening: No; Length: 10mm; Packaging: Tape and Reel; Height: 10mm; Height - Seated (Max): 0.394inch
C31-C33 C38-C40 = Generic CAP 0603
  C31 C33 C38 C40: Value: 100n
  C32 C39: Value: 1u
D6 D7 = Generic LED 0603
P2 = CMP-2000-07330-1: Post Terminal Strip Assembly, Pitch 2.54 mm, 2 x 5 Position, Height 8.58 mm, Tail Length 2.54 mm, -55 to 125 degC, RoHS, Bulk; Manufacturer: Samtec-Inc.; Connector Type: Header,Unshrouded; Number of Positions Loaded: All; Pitch: 0.100"(2.54mm); Number of Positions: 10; Package Reference: TSW-105-07-G-D; Mounting Technology: ThroughHole; Datasheet URL: http://suddendocs.samtec.com/prints/tsw-xxx-xx-xxx-x-xx-xxx-mkt.pdf; Termination: Solder; Packaging: Bulk; Number of Rows: 2; Contact Finish: Gold; Mounting Type: ThroughHole; Features: -; Color: Black; Category: Connectors,Interconnects; Family: RectangularConnectors-Headers,MalePins; Manufacturer URL: http://www.samtec.com/; Series: TSW; Fastening Type: -; Package URL: http://suddendocs.samtec.com/prints/tsw-xxx-xx-x-x-xx-xxx-footprint.pdf; Row Spacing: 0.100"(2.54mm); Contact Mating Length: 0.230"(5.84mm); Contact Finish Thickness: 10µin(0.25µm); Contact Type: MalePin; Package Description: Male Header, Pitch 2.54 mm, 2 x 5 Position, Height 8.58 mm, Tail Length 2.54 mm; Datasheet Version: Rev. DO, 08/1988
Q2-Q9 = CMP-32901-000490-1: MOSFET N-CH 40V 100A 8QFN; Input Capacitance: 6.56nF; Threshold Voltage: 3.9V; Rds On Max: 1.25mR; Mount: Surface Mount; Drain to Source Voltage (Vdss): 40V; Max Operating Temperature: 150°C; Continuous Drain Current (ID): 100A; Min Operating Temperature: -55°C; Packaging: Tape and Reel; Max Dual Supply Voltage: 40V; Number of Pins: 8; Lead Free: Lead Free; Halogen Free: Halogen Free; REACH SVHC: No SVHC
R13-R18 = Generic RES 0402
  R13 R14 R16 R17: Value: 10k
  R15 R18: Value: 3.16k
U6 U7 = CMP-04915-000069-1: IC MOTOR DRIVER 0V-5.5V 24VQFN; Interface: Parallel; Lead Free: Lead Free; Mount: Surface Mount; Max Operating Temperature: 125°C; Min Operating Temperature: -40°C; Case/Package: VQFN; RoHS Compliant: Yes; Packaging: Tape and Reel

## Sheet 6_laser driver.SchDoc
size A4; SheetNumber: 6; SheetTotal: 7
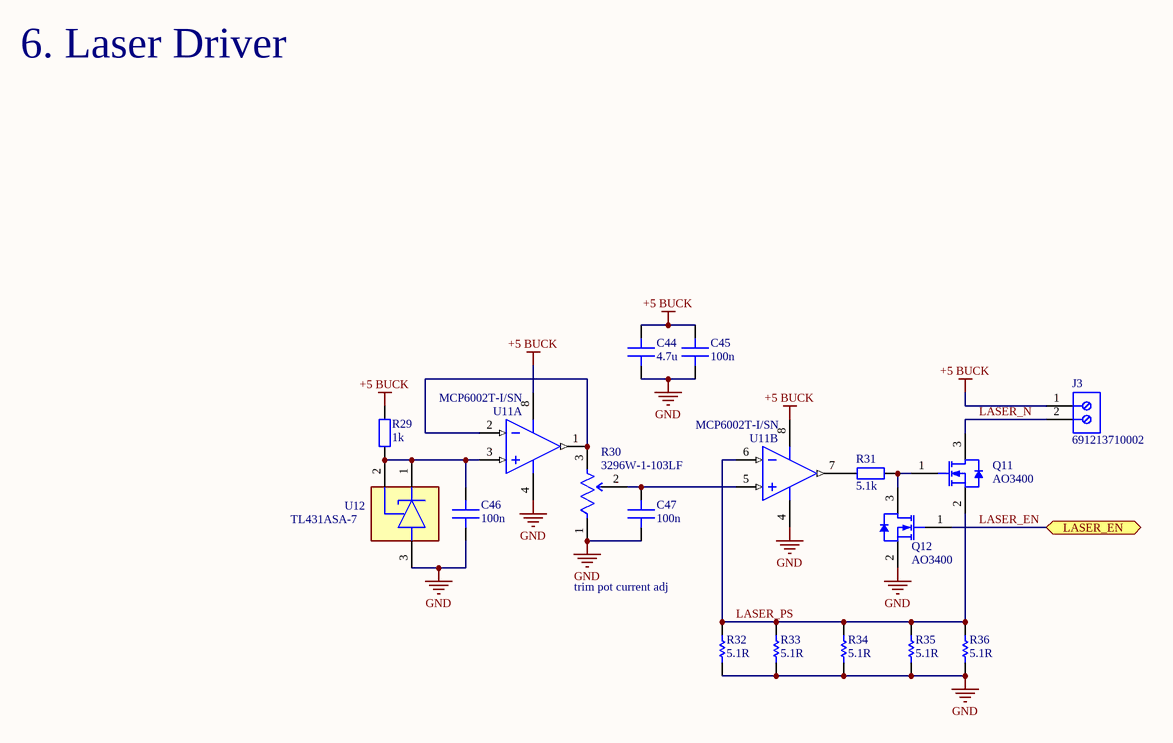
[diagram p5: 6_laser driver.SchDoc]

### Parts
C44  4.7u  [IPC C C0603 NO SILK]
C45  100n  [IPC C C0402 NO SILK]
C46  100n  [IPC C C0402 NO SILK]
C47  100n  [IPC C C0402 NO SILK]
J3  691213710002  [691213710002]
Q11  AO3400  [AO-SOT23-3_V]
Q12  AO3400  [AO-SOT23-3_V]
R29  1k  [IPC C R0402 NO SILK]
R30  3296W-1-103LF  [FP-3296W-MFG]
R31  5.1k  [IPC C R0402 NO SILK]
R32  5.1R  [RESC2013X70X40LL20T20]
R33  5.1R  [RESC2013X70X40LL20T20]
R34  5.1R  [RESC2013X70X40LL20T20]
R35  5.1R  [RESC2013X70X40LL20T20]
R36  5.1R  [RESC2013X70X40LL20T20]
U11  MCP6002T-I/SN  [SOIC-SN8_N]  (parts A,B of 2)
U12  TL431ASA-7  [FP-SOT23-MFG]

### Ports
LASER_EN (bidir, see 2_mcu[4C])

### Nets
+5 BUCK: C44.2 C45.2 J3.1 R29.2 U11.8(VDD)
GND: C44.1 C45.1 C46.1 C47.1 Q12.2(S) R30.1(CCW) R32.1 R33.1 R34.1 R35.1 R36.1 U11.4(VSS) U12.3(A)
LASER_EN: Q12.1(G) ; port LASER_EN
LASER_N: J3.2 Q11.3(D)
LASER_PS: Q11.2(S) R32.2 R33.2 R34.2 R35.2 R36.2 U11.6(VINB-)
NetC46_2: C46.2 R29.1 U11.3(VINA+) U12.1(C) U12.2(REF)
NetC47_2: C47.2 R30.2(WIPER) U11.5(VINB+)
NetQ11_1: Q11.1(G) Q12.3(D) R31.2
NetR30_3: R30.3(CW) U11.1(VOUTA) U11.2(VINA-)
NetR31_1: R31.1 U11.7(VOUTB)

### Notes on the sheet
- 6. Laser Driver
- trim pot current adj

### Library data of the parts
C44 = Generic CAP 0603: Value: 4.7u
C45-C47 = Generic CAP 0402: Value: 100n
J3 = CMP-1502-02526-2: NexarPartId: 8917718; Number of Contacts: 2; Current Rating: 10A; Stripping Length: -7mm; Wire Gauge (Max): 26AWG; Plating: Brass, Steel; Wire Gauge (Min): 16AWG; Voltage: 300V; Number of Levels: 1; Pitch: 5.0038mm; Color: Green; Number of Pins: 2; Housing Material: Nylon; Termination: Screw; Max Operating Temperature: 105°C; Min Operating Temperature: -40°C; Packaging: Box; Current: 10A; REACH SVHC: Unknown; Width: 10.6mm; RoHS: Compliant; Mount: Through Hole; Height: 10mm; Contact Material: Brass; Length: 8.3mm; Lead Pitch: 5mm; Wire/Cable Gauge: 26AWG; Voltage Rating: 300V; Number of Positions Per Level: 2; Contact Plating: Tin
Q11 Q12 = CMP-0278-00001-1: as Q1 on sheet 4_connection; PackageDescription: 3-Pin SOT23, 3.016 x 2.8 mm Body, 0.95 mm Pitch; ComponentLink2Description: Datasheet; DatasheetVersion: Rev.8, 12/2011; ComponentLink3URL: http://www.aosmd.com/res/packaging_information/SOT-23.pdf; Storage Temperature: -55 to 150 degC; ComponentLink3Description: Package Specification; PackageReference: SOT23; ComponentLink1Description: Manufacturer URL; Mounting Technology: Surface Mount; ComponentLink1URL: http://www.aosmd.com/; PartNumber: AO3400; ComponentLink2URL: http://www.aosmd.com/res/data_sheets/AO3400.pdf
R29 R31 = Generic RES 0402
  R29: Value: 1k
  R31: Value: 5.1k
R30 = CMP-1747-00001-8: TRIMMER 10K OHM 0.5W PC PIN TOP; Number of Turns: 25; Tolerance: 10%; Resistance: 10kR; Max Power Dissipation: 500mW; Temperature Coefficient: 100ppm/°C; Insulation Resistance: 1GR; Min Operating Temperature: -55°C; Resistor Type: Cermet; Series: 3296; Color: Blue; Mount: Through Hole; Taper: Linear; Radiation Hardening: No; RoHS Compliant: Yes; Width: 9.53mm; Resistance Tolerance: 10%; Contact Plating: Tin; Military Standard: Not; Package Quantity: 50; Weight: 0.03oz; Lead Free: Lead Free; Power Rating: 500mW; Termination: Pin; Technology: CERMET; Max Operating Temperature: 125°C; Packaging: Rail/Tube; Length: 9.53mm; Depth: 4.83mm; Height: 11.55mm; Reach SVHC Compliant: Yes
R32-R36 = CMP-2001-00435-1: Part Number: ERJ-6GEYJ5R1V; Manufacturer: Panasonic
U11 = CMP-0187-00288-3: None; Supply Current: 100uA; Number of Circuits: 2; Operating Supply Voltage: 5.5V; Min Supply Voltage: 1.8V; Input Offset Voltage-Max: 4.5mV; Common Mode Rejection Ratio: 60dB; Slew Rate: 0.6V/µs; Output Current: 23mA; Max Frequency: 1kHz; Max Supply Voltage: 6V; Unity Gain Bandwidth Product: 1MHz; Amplifier Type: GENERAL PURPOSE; Voltage Gain: 112dB; Input Bias Current: 1pA; Power Supply Rejection Ratio (PSRR): 86dB; Packaging: Tape and Reel; Case/Package: SOIC; Operating Supply Current: 100uA; Radiation Hardening: No; Number of Elements: 2; Number of Channels: 2; Height: 1.5mm; Min Operating Temperature: -40°C; Slew Rate-Nom: 0.6V/µs; Max Operating Temperature: 85°C; Mount: Surface Mount; Output Current per Channel: 23mA; Series: -; Gain Bandwidth Product: 1MHz; Length: 8.65mm; Technology: CMOS; Number of Pins: 8; Input Offset Voltage (Vos): 4.5mV; Width: 3.9mm; Package Quantity: 3300; Nominal Supply Current: 100uA; Lead Free: Lead Free; RoHS Compliant: Yes
U12 = CMP-12755-000001-1: IC VREF SHUNT ADJ SOT23-3; Manufacturer: DIODES INC.; Standoff Height: 0.013mm; Max Power Dissipation: 330mW; Max Junction Temp: +150°C; Output Type: AdjustableProgrammable; Octopart: https://octopart.com/tl431asa-7-diodes+inc.-18832779; Automotive: No; Digikey Description: IC VREF SHUNT ADJ SOT23-3; Temperature: to +150°C; Ambient Temperature Range High: +125°C; Ipc Land Pattern Name: SOT92P240X102-3; ComponentLink2URL: https://www.diodes.com/assets/Datasheets/TL431_432.pdf; RoHS: TRUE; Manufacturer Part Number: TL431ASA-7; Reference Type: Shunt; Mouser Description: V-Ref Adjustable 2.495V to 36V 100mA 3-Pin SOT-23 T/R; Package: SOT23; Ambient Temperature Range Low: -40°C; Device Class L3: Voltage References; Temperature Range High: +150°C; ComponentLink2Description: Datasheet; Footprint Url: https://www.diodes.com/assets/Package-Files/SOT23.pdf; Category: IC; Device Class L2: Power Management ICs; Device Class L1: Integrated Circuits (ICs); Lead Free: Yes; Height: 1.1mm

## Sheet 7_peripherals.SchDoc
size A4; SheetNumber: 7; SheetTotal: 7
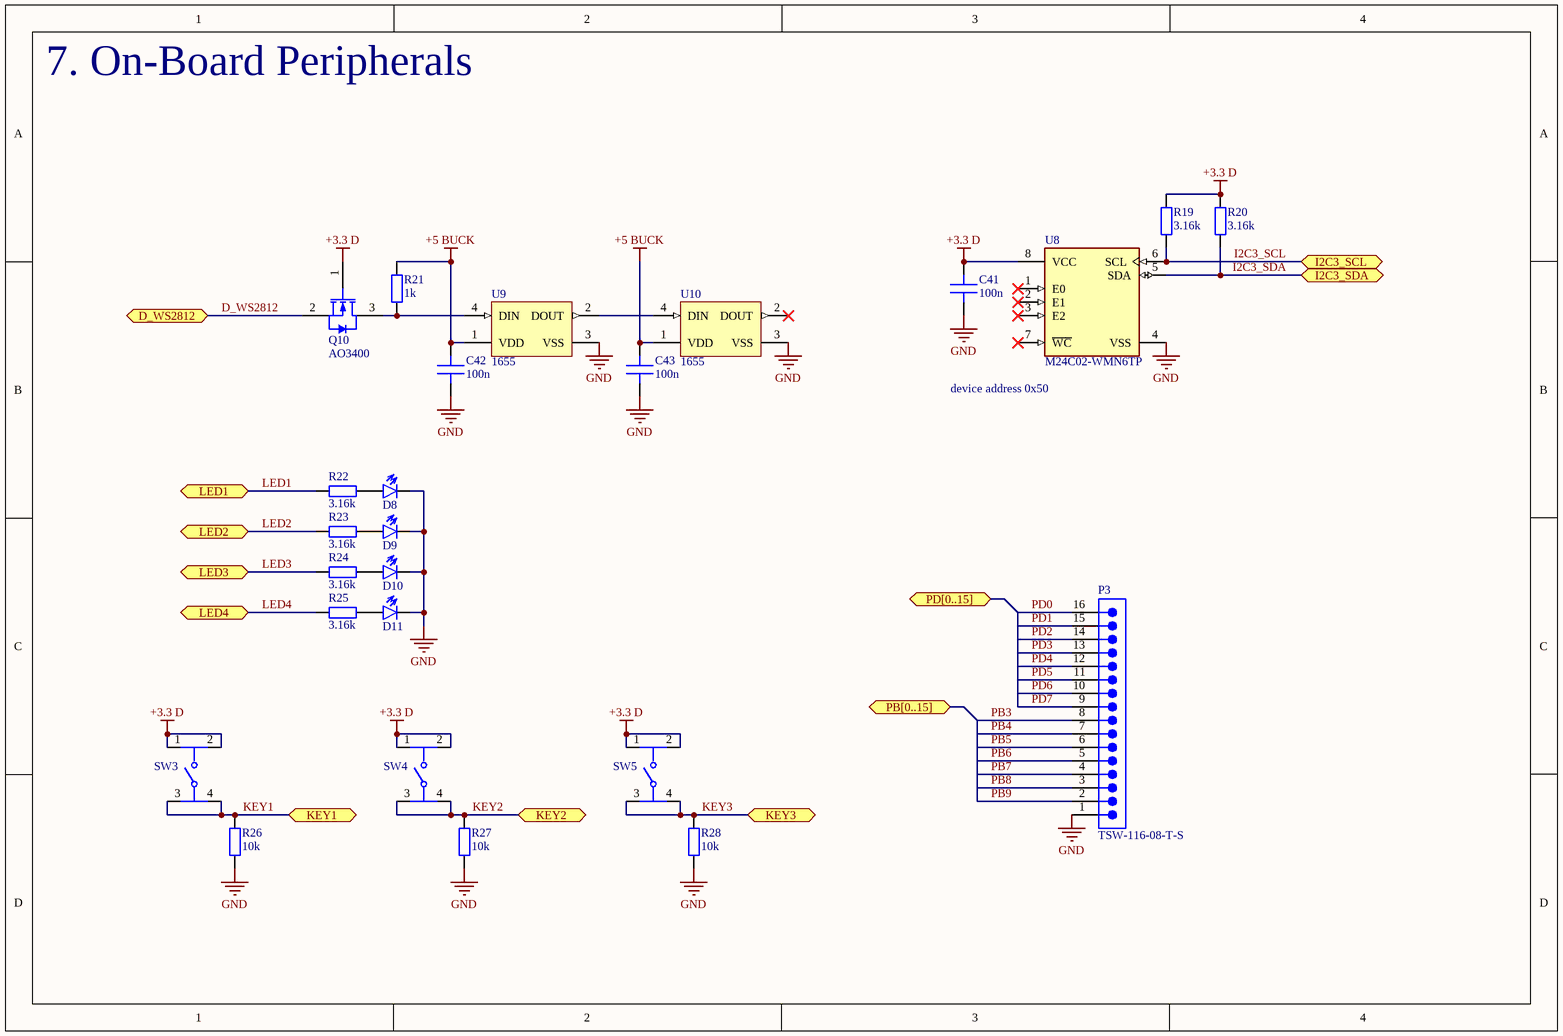
[diagram p6: 7_peripherals.SchDoc]

### Parts
C41  100n  [IPC C C0402 NO SILK]
C42  100n  [IPC C C0402 NO SILK]
C43  100n  [IPC C C0402 NO SILK]
D8  Yellow LED 0603  [IPC C D0603]  (value not drawn)
D9  Yellow LED 0603  [IPC C D0603]  (value not drawn)
D10  Yellow LED 0603  [IPC C D0603]  (value not drawn)
D11  Yellow LED 0603  [IPC C D0603]  (value not drawn)
P3  TSW-116-08-T-S  [SMTC-TSW-116-08-X-S]
Q10  AO3400  [AO-SOT23-3_V]
R19  3.16k  [IPC C R0402 NO SILK]
R20  3.16k  [IPC C R0402 NO SILK]
R21  1k  [IPC C R0402 NO SILK]
R22  3.16k  [IPC C R0402 NO SILK]
R23  3.16k  [IPC C R0402 NO SILK]
R24  3.16k  [IPC C R0402 NO SILK]
R25  3.16k  [IPC C R0402 NO SILK]
R26  10k  [IPC C R0402 NO SILK]
R27  10k  [IPC C R0402 NO SILK]
R28  10k  [IPC C R0402 NO SILK]
SW3  PTS810SJM250SMTRLFS  [FP-PTS810SJM250SMTRLFS-MFG]  (value not drawn)
SW4  PTS810SJM250SMTRLFS  [FP-PTS810SJM250SMTRLFS-MFG]  (value not drawn)
SW5  PTS810SJM250SMTRLFS  [FP-PTS810SJM250SMTRLFS-MFG]  (value not drawn)
U8  M24C02-WMN6TP  [FP-SO8N-SO-A-MFG]
U9  1655  [ADA-RGB-1655_V]
U10  1655  [ADA-RGB-1655_V]

### Ports
D_WS2812 (bidir, see 2_mcu[1D]), I2C3_SCL (bidir, see 2_mcu[3C]), I2C3_SDA (bidir, see 2_mcu[3D]), KEY1 (bidir, see 2_mcu[2C]), KEY2 (bidir, see 2_mcu[2C]), KEY3 (bidir, see 2_mcu[2D]), LED1 (bidir, see 2_mcu[3D]), LED2 (bidir, see 2_mcu[3D]), LED3 (bidir, see 2_mcu[3D]), LED4 (bidir, see 2_mcu[3C]), PB[0..15] (bidir, see 2_mcu[4B]), PD[0..15] (bidir, see 2_mcu[1C])

### Nets
+3.3 D: C41.2 Q10.1(G) R19.2 R20.2 SW3.1 SW3.2 SW4.1 SW4.2 SW5.1 SW5.2 U8.8(VCC)
+5 BUCK: C42.2 C43.2 R21.2 U9.1(VDD) U10.1(VDD)
GND: C41.1 C42.1 C43.1 D8.2(C) D9.2(C) D10.2(C) D11.2(C) P3.1 R26.2 R27.2 R28.2 U8.4(VSS) U9.3(VSS) U10.3(VSS)
D_WS2812: Q10.2(S) ; port D_WS2812
I2C3_SCL: R19.1 U8.6(SCL) ; port I2C3_SCL
I2C3_SDA: R20.1 U8.5(SDA) ; port I2C3_SDA
KEY1: R26.1 SW3.3 SW3.4 ; port KEY1
KEY2: R27.1 SW4.3 SW4.4 ; port KEY2
KEY3: R28.1 SW5.3 SW5.4 ; port KEY3
LED1: R22.2 ; port LED1
LED2: R23.2 ; port LED2
LED3: R24.2 ; port LED3
LED4: R25.2 ; port LED4
PB3: P3.8
PB4: P3.7
PB5: P3.6
PB6: P3.5
PB7: P3.4
PB8: P3.3
PB9: P3.2
PD0: P3.16
PD1: P3.15
PD2: P3.14
PD3: P3.13
PD4: P3.12
PD5: P3.11
PD6: P3.10
PD7: P3.9
NetD8_1: D8.1(A) R22.1
NetD9_1: D9.1(A) R23.1
NetD10_1: D10.1(A) R24.1
NetD11_1: D11.1(A) R25.1
NetQ10_3: Q10.3(D) R21.1 U9.4(DIN)
NetU9_2: U9.2(DOUT) U10.4(DIN)

Not connected (* = marked no-connect by the designer): U8 1(E0)* 2(E1)* 3(E2)* 7(~{WC})*; U10 2(DOUT)*

### Notes on the sheet
- 7. On-Board Peripherals
- (near U8) device address 0x50

### Library data of the parts
C41-C43 = Generic CAP 0402: Value: 100n
D8-D11 = Generic LED 0603
P3 = CMP-1024-00438-1: 0.025" SQ Post Header, Through-hole, Vertical, -55 to 105 degC, 2.54 mm Pitch, 16-Pin, Male, RoHS; Manufacturer: Samtec; Pitch: 2.54 mm; PackageDescription: .025[0.64] SQ. Post Terminal Strip Assembly; Orientation: Vertical; DatasheetVersion: F-214; ComponentLink2URL: http://www.samtec.com/documents/webfiles/pdf/TSW_TH.PDF; ComponentLink3URL: http://www.samtec.com/documents/webfiles/cpdf/TSW-XXX-XX-XXX-X-XX-XXX-MKT.pdf; ComponentLink1URL: http://www.samtec.com; PackageReference: TSW-116-08-X-S; ComponentLink2Description: Datasheet; ComponentLink1Description: Manufacturer URL; ComponentLink3Description: Package Specification; Temperature Range: -55 to 105 degC; Mounting Technology: Through-hole; PartNumber: TSW-116-08-T-S; PackageVersion: DM, 8/1988; RoHS: True
Q10 = CMP-0278-00001-1: as Q1 on sheet 4_connection; PackageDescription: 3-Pin SOT23, 3.016 x 2.8 mm Body, 0.95 mm Pitch; ComponentLink2Description: Datasheet; DatasheetVersion: Rev.8, 12/2011; ComponentLink3URL: http://www.aosmd.com/res/packaging_information/SOT-23.pdf; Storage Temperature: -55 to 150 degC; ComponentLink3Description: Package Specification; PackageReference: SOT23; ComponentLink1Description: Manufacturer URL; Mounting Technology: Surface Mount; ComponentLink1URL: http://www.aosmd.com/; PartNumber: AO3400; ComponentLink2URL: http://www.aosmd.com/res/data_sheets/AO3400.pdf
R19-R28 = Generic RES 0402
  R19 R20 R22-R25: Value: 3.16k
  R21: Value: 1k
  R26-R28: Value: 10k
SW3-SW5 = CMP-10040-000001-2: as SW1 on sheet 2_mcu; Package Quantity: 2900; Depth: 4.6mm; Mount: Surface Mount; Packaging: Tape and Reel; Length: 3.2mm; RoHS Compliant: Yes; Case/Package: SMD/SMT; Voltage Rating (DC): 16V; Min Operating Temperature: -40°C; Termination: J-Bend; Lead Free: Lead Free; Contact Plating: Silver; Orientation: Straight; Max Operating Temperature: 85°C; Current Rating: 50mA; Color: Black
U8 = CMP-2000-05370-2: IC EEPROM 2K I2C 400KHZ 8SO; Manufacturer: STMicroelectronics; Min Supply Voltage: 2.5V; Standoff Height: 0.1mm; Nominal Supply Current: 0.5-1mA; Access Time: 900ns; Memory Size: 2Kbits; Max Supply Voltage: 5.5V; Digikey Description: IC EEPROM 2K I2C 400KHZ 8SO; Memory Type: EEPROM; ComponentLink2URL: https://www.st.com/resource/en/datasheet/m24c02-w.pdf; Device Class L3: EEPROM; Interface: I2C; Temperature Range High: +85°C; Mouser Description: M24C02 Series 2 Kb (256 x 8) 2.5 V SMT Serial I²C Bus EEPROM - SOIC-8; RoHS: TRUE; Lead Free: Yes; Ambient Temperature Range Low: -40°C; Temperature: -40°C to +85°C; Device Class L1: Integrated Circuits (ICs); Temperature Range Low: -40°C; Frequency: 400kHz; Category: IC; Manufacturer Part Number: M24C02-WMN6TP; Height: 1.75mm; Octopart: https://octopart.com/m24c02-wmn6tp-stmicroelectronics-55404516; Automotive: No; Ambient Temperature Range High: +85°C; ComponentLink2Description: Datasheet; Package: SO8N-SO-A; Device Class L2: Memory
U9 U10 = CMP-2000-05026-1: Intelligent Control LED Integrated Light Source, 3.5 to 5.3 V, -25 to 80 degC, 4-Pin SMD, RoHS, Tape and Reel; Manufacturer: Adafruit-Industries-LLC; Number of LEDs: 10; Configuration: Discrete; Utilized LED: WS2812(5050); Datasheet URL: http://datasheet.octopart.com/ADA1655-Adafruit-Industries-datasheet-32028139.pdf; Series: Neopixel; Interface: -; Package Description: 4-Pin Surface Mount Device, Body 5 x 5 mm; Color: Red,Green,Blue(RGB); Category: Optoelectronics; Controller Type: -; Package Reference: 1655; Manufacturer URL: https://www.adafruit.com/; Mounting Type: SurfaceMount; Datasheet Version: May-13; Size / Dimension: 5.00mmLx5.00mmW; Family: Addressable,Specialty

## Nets that join several sheets
+3.3 A: 2_mcu (C11.2 C12.2 U1.20 U1.21), 3_power (C21.2 R12.2 U4.2)
+3.3 D: 2_mcu (15 pins), 3_power (5 pins), 4_connection (P1.2 Q1.3), 7_peripherals (11 pins)
+5 BUCK: 3_power (10 pins), 5_motor driver (P2.3 P2.4 R13.2 R16.2), 6_laser driver (5 pins), 7_peripherals (5 pins)
+5 USB: 3_power (D5.2), 4_connection (8 pins)
+24: 3_power (C17.1 C18.1 C19.1 U3.7), 5_motor driver (14 pins)
GND: 2_mcu (24 pins), 3_power (19 pins), 4_connection (21 pins), 5_motor driver (34 pins), 6_laser driver (13 pins), 7_peripherals (14 pins)
D_WS2812: 2_mcu (U1.59), 7_peripherals (Q10.2)
ENC1A: 2_mcu (U1.63), 5_motor driver (P2.5)
ENC1B: 2_mcu (U1.64), 5_motor driver (P2.7)
ENC2A: 2_mcu (U1.23), 5_motor driver (P2.6)
ENC2B: 2_mcu (U1.22), 5_motor driver (P2.8)
HOME1: 2_mcu (U1.25), 5_motor driver (P2.9)
HOME2: 2_mcu (U1.24), 5_motor driver (P2.10)
I2C3_SCL: 2_mcu (U1.67), 7_peripherals (R19.1 U8.6)
I2C3_SDA: 2_mcu (U1.66), 7_peripherals (R20.1 U8.5)
KEY1: 2_mcu (U1.97), 7_peripherals (R26.1 SW3.3 SW3.4)
KEY2: 2_mcu (U1.98), 7_peripherals (R27.1 SW4.3 SW4.4)
KEY3: 2_mcu (U1.1), 7_peripherals (R28.1 SW5.3 SW5.4)
LASER_EN: 2_mcu (U1.51), 6_laser driver (Q12.1)
LED1: 2_mcu (U1.80), 7_peripherals (R22.2)
LED2: 2_mcu (U1.79), 7_peripherals (R23.2)
LED3: 2_mcu (U1.78), 7_peripherals (R24.2)
LED4: 2_mcu (U1.77), 7_peripherals (R25.2)
M1_IN1: 2_mcu (U1.43), 5_motor driver (U6.15)
M1_IN2: 2_mcu (U1.44), 5_motor driver (U6.14)
M2_IN1: 2_mcu (U1.39), 5_motor driver (U7.15)
M2_IN2: 2_mcu (U1.41), 5_motor driver (U7.14)
RXD: 2_mcu (U1.68), 4_connection (U2.9)
SWCLK: 2_mcu (U1.76), 4_connection (P1.4)
SWDIO: 2_mcu (U1.72), 4_connection (P1.3)
TXD: 2_mcu (U1.69), 4_connection (U2.8)
USB1D_N: 2_mcu (U1.70), 4_connection (J1.A7 J1.B7)
USB1D_P: 2_mcu (U1.71), 4_connection (J1.A6 J1.B6)